# EAGLE design Shruti-Main-v03 (EAGLE 5.06)
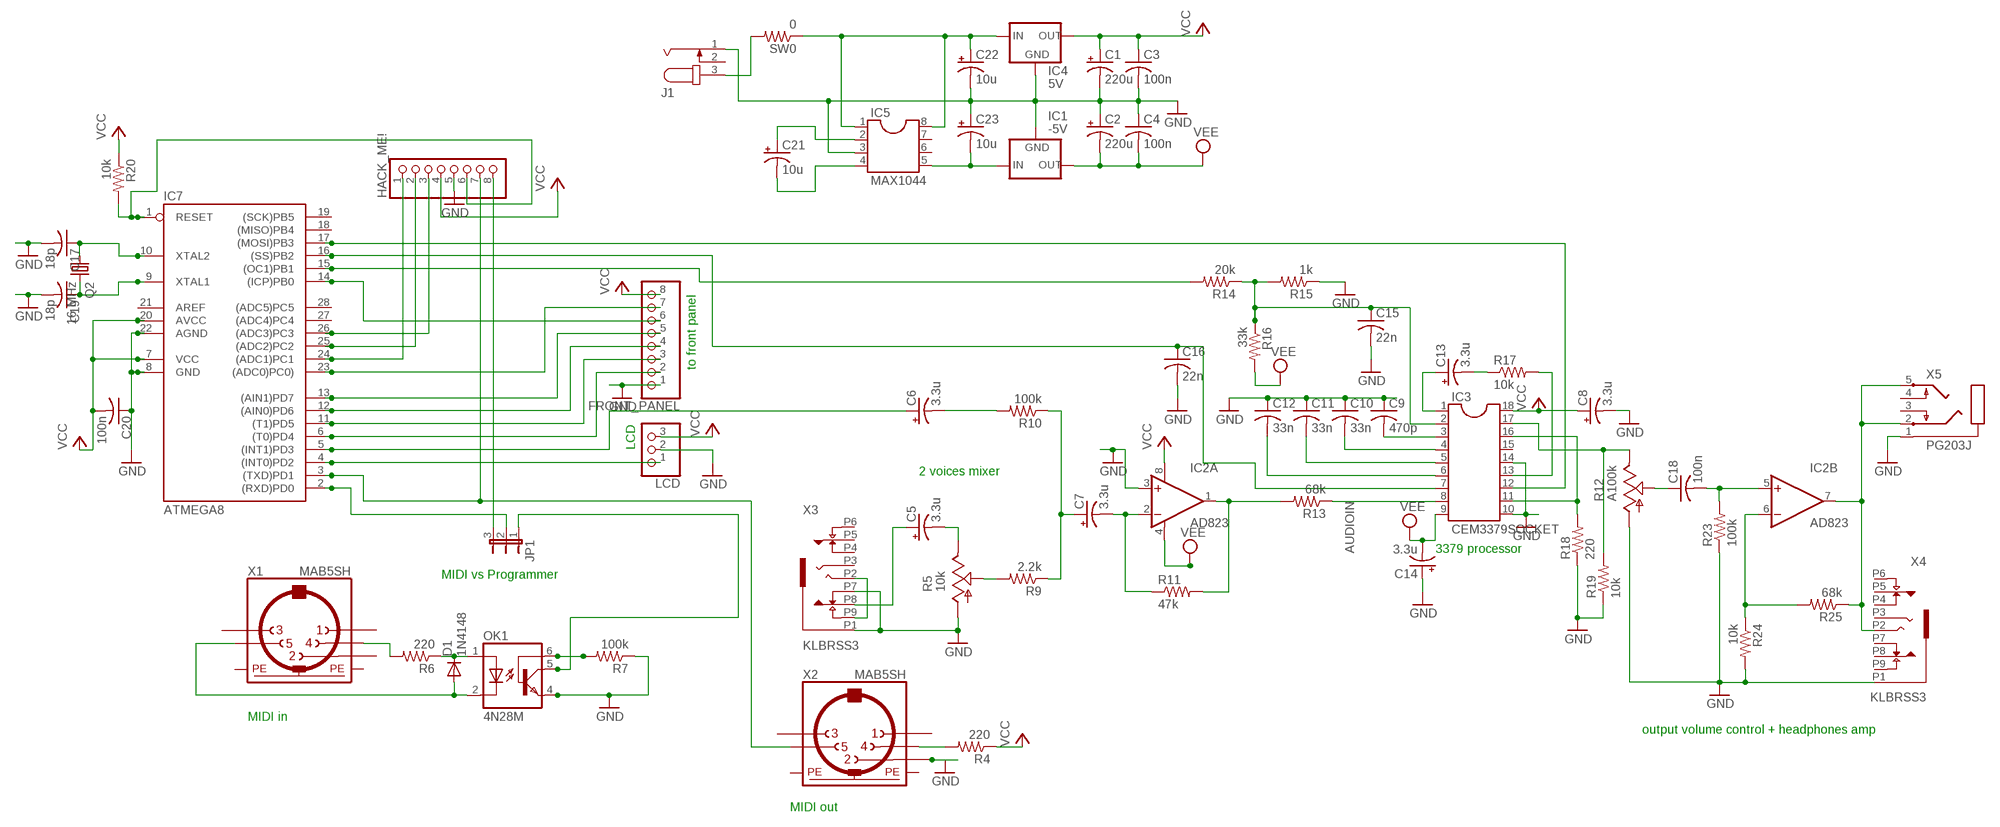
[diagram p0: schematic, sheet 1]

## Parts
C1  220u  CPOL-USE5-8.5  [E5-8,5]
C2  220u  CPOL-USE5-8.5  [E5-8,5]
C3  100n  C-US050-024X044  [C050-024X044]
C4  100n  C-US050-024X044  [C050-024X044]
C5  3.3u  CPOL-USE2.5-6  [E2,5-6]
C6  3.3u  CPOL-USE2.5-6  [E2,5-6]
C7  3.3u  CPOL-USE2.5-6  [E2,5-6]
C8  3.3u  CPOL-USE2.5-6  [E2,5-6]
C9  470p  C-US050-024X044  [C050-024X044]
C10  33n  C-US050-025X075  [C050-025X075]
C11  33n  C-US050-025X075  [C050-025X075]
C12  33n  C-US050-025X075  [C050-025X075]
C13  3.3u  CPOL-USE2.5-6  [E2,5-6]
C14  3.3u  CPOL-USE2.5-6  [E2,5-6]
C15  22n  C-US050-025X075  [C050-025X075]
C16  22n  C-US050-025X075  [C050-025X075]
C17  18p  C-US050-024X044  [C050-024X044]
C18  100n  C-US050-024X044  [C050-024X044]
C19  18p  C-US050-024X044  [C050-024X044]
C20  100n  C-US050-024X044  [C050-024X044]
C21  10u  CPOL-USE2.5-6  [E2,5-6]
C22  10u  CPOL-USE2.5-6  [E2,5-6]
C23  10u  CPOL-USE2.5-6  [E2,5-6]
D1  1N4148  1N4148DO35-7  [DO35-7]
FRONT_PANEL  PINHD-1X8  [1X08]
HACK_ME!  PINHD-1X8  [1X08]
IC1  -5V  79XXL  [79XXL]
IC2  AD823  OPA2132P  [DIL08]
IC3  CEM3379SOCKET  [SOCKET18]
IC4  5V  78XXL  [78XXL]
IC5  MAX1044  DIL8  [DIL08]
IC7  ATMEGA8  AT90S4433P  [DIL28-3]
J1  JACK-PLUG1  [SPC4078]
JP1  JP2E  [JP2]
LCD  PINHD-1X3  [1X03]
OK1  4N28M  [DIL06]
Q2  16 MHz  CRYSTALHC49U-V  [HC49U-V]
R4  220  R-US_0204/7  [0204/7]
R5  10k  POT_USCABLED  [CABLE_POT_6MM]
R6  220  R-US_0204/7  [0204/7]
R7  100k  R-US_0204/7  [0204/7]
R9  2.2k  R-US_0204/7  [0204/7]
R10  100k  R-US_0204/7  [0204/7]
R11  47k  R-US_0204/7  [0204/7]
R12  A100k  POT_USCABLED  [CABLE_POT_6MM]
R13  68k  R-US_0204/7  [0204/7]
R14  20k  R-US_0204/7  [0204/7]
R15  1k  R-US_0204/7  [0204/7]
R16  33k  R-US_0204/7  [0204/7]
R17  10k  R-US_0204/7  [0204/7]
R18  220  R-US_0204/7  [0204/7]
R19  10k  R-US_0204/7  [0204/7]
R20  10k  R-US_0204/7  [0204/7]
R23  100k  R-US_0204/7  [0204/7]
R24  10k  R-US_0204/7  [0204/7]
R25  68k  R-US_0204/7  [0204/7]
SW0  0  R-US_0204/2V  [0204V]
X1  MAB5SH  [MAB5SH]
X2  MAB5SH  [MAB5SH]
X3  KLBRSS3  [KLBRSS3]
X4  KLBRSS3  [KLBRSS3]
X5  PG203J  [PG203J]

## Nets
AUDIOIN: IC2.1(A:OUT) R11.2 R13.2
GND: C1.- C2.+ C3.2 C4.1 C8.- C9.1 C10.1 C11.1 C12.1 C14.+ C15.2 C16.2 C17.2 C19.2 C20.1 C22.- C23.+ FRONT_PANEL.1 HACK_ME!.5 IC1.GND IC2.3(A:+IN) IC3.10(GND) IC3.14(PANCV) IC4.GND IC5.3 IC7.8(GND) IC7.22(AGND) J1.1 LCD.2 OK1.4(EMI) R5.A R7.1 R12.A R15.1 R18.1 R19.1 R23.1 R24.2 X2.2 X3.P1 X3.P7 X4.P1 X5.1
N$1: HACK_ME!.8 JP1.3
N$2: C22.+ IC4.IN IC5.1 IC5.8 SW0.1
N$3: C21.+ IC5.2
N$4: FRONT_PANEL.2 IC7.6((T0)PD4)
N$5: IC3.8(VCFIN) R13.1
N$6: R4.2 X2.4
N$7: HACK_ME!.2 IC7.25((ADC2)PC2)
N$8: FRONT_PANEL.7 IC7.23((ADC0)PC0))
N$9: FRONT_PANEL.4 IC7.12((AIN0)PD6)
N$10: FRONT_PANEL.5 IC7.13((AIN1)PD7)
N$11: IC7.4((INT0)PD2) LCD.1
N$12: C6.- R10.2
N$13: HACK_ME!.7 IC7.3((TXD)PD1) X2.5
N$14: D1.C OK1.1(A) R6.1
N$15: C17.1 IC7.10(XTAL2) Q2.1
N$16: D1.A OK1.2(C) X1.5
N$17: R6.2 X1.4
N$18: JP1.1 OK1.5(COL)
N$19: R5.S R9.2
N$20: C6.+ IC7.5((INT1)PD3)
N$21: C7.- IC2.2(A:-IN) R11.1
N$22: FRONT_PANEL.3 IC7.11((T1)PD5)
N$23: C7.+ R9.1 R10.1
N$25: C18.2 IC2.5(B:+IN) R23.2
N$26: C9.2 IC3.3(CD)
N$27: C10.2 IC3.4(CC)
N$28: C5.- R5.E
N$29: C11.2 IC3.5(CB)
N$30: IC3.17(CHB) R12.E R19.2
N$31: C12.2 IC3.6(CA)
N$32: IC7.15((OC1)PB1) R14.2
N$33: C16.1 IC3.7(RESONANCECV) IC7.16((SS)PB2)
N$34: IC3.12(GAINCV) IC7.17((MOSI)PB3)
N$35: IC3.13(VCAIN) R17.2
N$36: C13.- R17.1
N$37: IC2.7(B:OUT) R25.1 X4.P2 X5.2 X5.5
N$38: IC3.11(VCAOUT) IC3.16(PANIN) R18.2
N$39: C13.+ IC3.1(VCFOUT)
N$41: C5.+ X3.P8
N$42: HACK_ME!.6 IC7.1(RESET) R20.2
N$43: C15.1 IC3.2(FREQUENCYCV) R14.1 R15.2 R16.1
N$44: C18.1 R12.S
N$45: IC2.6(B:-IN) R24.1 R25.2
N$47: J1.3 SW0.2
N$48: C19.1 IC7.9(XTAL1) Q2.2
N$49: HACK_ME!.3 IC7.26((ADC3)PC3)
N$50: FRONT_PANEL.6 IC7.14((ICP)PB0)
N$51: OK1.6(BAS) R7.2
N$52: HACK_ME!.1 IC7.24((ADC1)PC1)
N$53: IC7.2((RXD)PD0) JP1.2
N$55: C21.- IC5.4
N$56: C23.- IC1.IN IC5.5
N$57: X3.P2 X3.P9
VCC: C1.+ C3.1 C8.+ C20.2 FRONT_PANEL.8 HACK_ME!.4 IC2.8(A:V+) IC3.18(VCC) IC4.OUT IC7.7(VCC) IC7.20(AVCC) LCD.3 R4.1 R20.1
VEE: C2.- C4.2 C14.- IC1.OUT IC2.4(A:V-) IC3.9(VEE) R16.2
Unconnected: IC3.15(CHAOUT) IC5.6 IC5.7 IC7.18((MISO)PB4) IC7.19((SCK)PB5) IC7.21(AREF) IC7.27((ADC4)PC4) IC7.28((ADC5)PC5) J1.2 X1.1 X1.2 X1.3 X2.1 X2.3 X3.P3 X3.P4 X3.P5 X3.P6 X4.P3 X4.P4 X4.P5 X4.P6 X4.P7 X4.P8 X4.P9 X5.3 X5.4

## Notes on the sheet
- to front panel
- LCD
- 2 voices mixer
- 3379 processor
- MIDI vs Programmer
- MIDI in
- output volume control + headphones amp
- MIDI out

## Power pins joined to a net without a drawn wire
PE: X1.PE X1.PE@(PE) X2.PE X2.PE@(PE)

## Library data of the parts
C1 C2 C5-C8 C13 C14 C21-C23 = rcl:CPOL-US: POLARIZED CAPACITOR, American symbol
C3 C4 C9-C12 C15-C20 = rcl:C-US: CAPACITOR, American symbol
D1 = diode:1N4148: DIODE high speed (Philips)
FRONT_PANEL HACK_ME! = pinhead:PINHD-1X8: PIN HEADER
IC1 = v-reg:79XXL: VOLTAGE REGULATOR
IC2 = burr-brown:OPA2132: High Speed FET-Input Operational Amplifiers< Product Folder:OPA2132
IC3 = cem:CEM3379: Voltage Controlled Signal Processor VCF+VCA+panner
IC4 = v-reg:78XXL: VOLTAGE REGULATOR
IC5 = ic-package:DIL8: Dual In Line / Socket
IC7 = atmel:AT90S4433: MICROCONTROLLER 4 Kbytes FLASH 128 bytes SRAM 256 bytes EEPROM UART 6-channel 10 bit ADC
J1 = con-jack:JACK-PLUG: DC POWER JACK Power Jack, DC, Right Angle, Through Hole, Rated 5A at 16VDC, PC Terminals Distributor: Farnell (www.Farnell.de) Drawing: 84N1161.pdf / 84N1162.pdf Manufacturer: SPC Technology (www.spctechnology.com) Type: SPC4077 / SPC 4078
JP1 = jumper:JP2E: JUMPER
LCD = pinhead:PINHD-1X3: PIN HEADER
OK1 = optocoupler:4N*?M: General Purpose 6-Pin Phototransistor Optocouplers Source: http://www.fairchildsemi.com/ds/4N/4N35-M.pdf
Q2 = crystal:CRYSTAL: CRYSTAL
R4 R6 R7 R9-R11 R13-R20 R23-R25 SW0 = resistor:R-US_: RESISTOR, American symbol
R5 R12 = pot-cable:POT_US
X1 X2 = con-hirschmann:MAB5SH: Female CONNECTOR 5 pins 90 deg. with shield, horizontal (DIN 41524)
X3 X4 = klbrss3:KLBRSS3: 6.35" Jack connector
X5 = con-hirschmann:PG203J: MIC/HEADPHONE JACK KS-S stereo microphone/headphone jack PG203JN (Schukat)

## Board
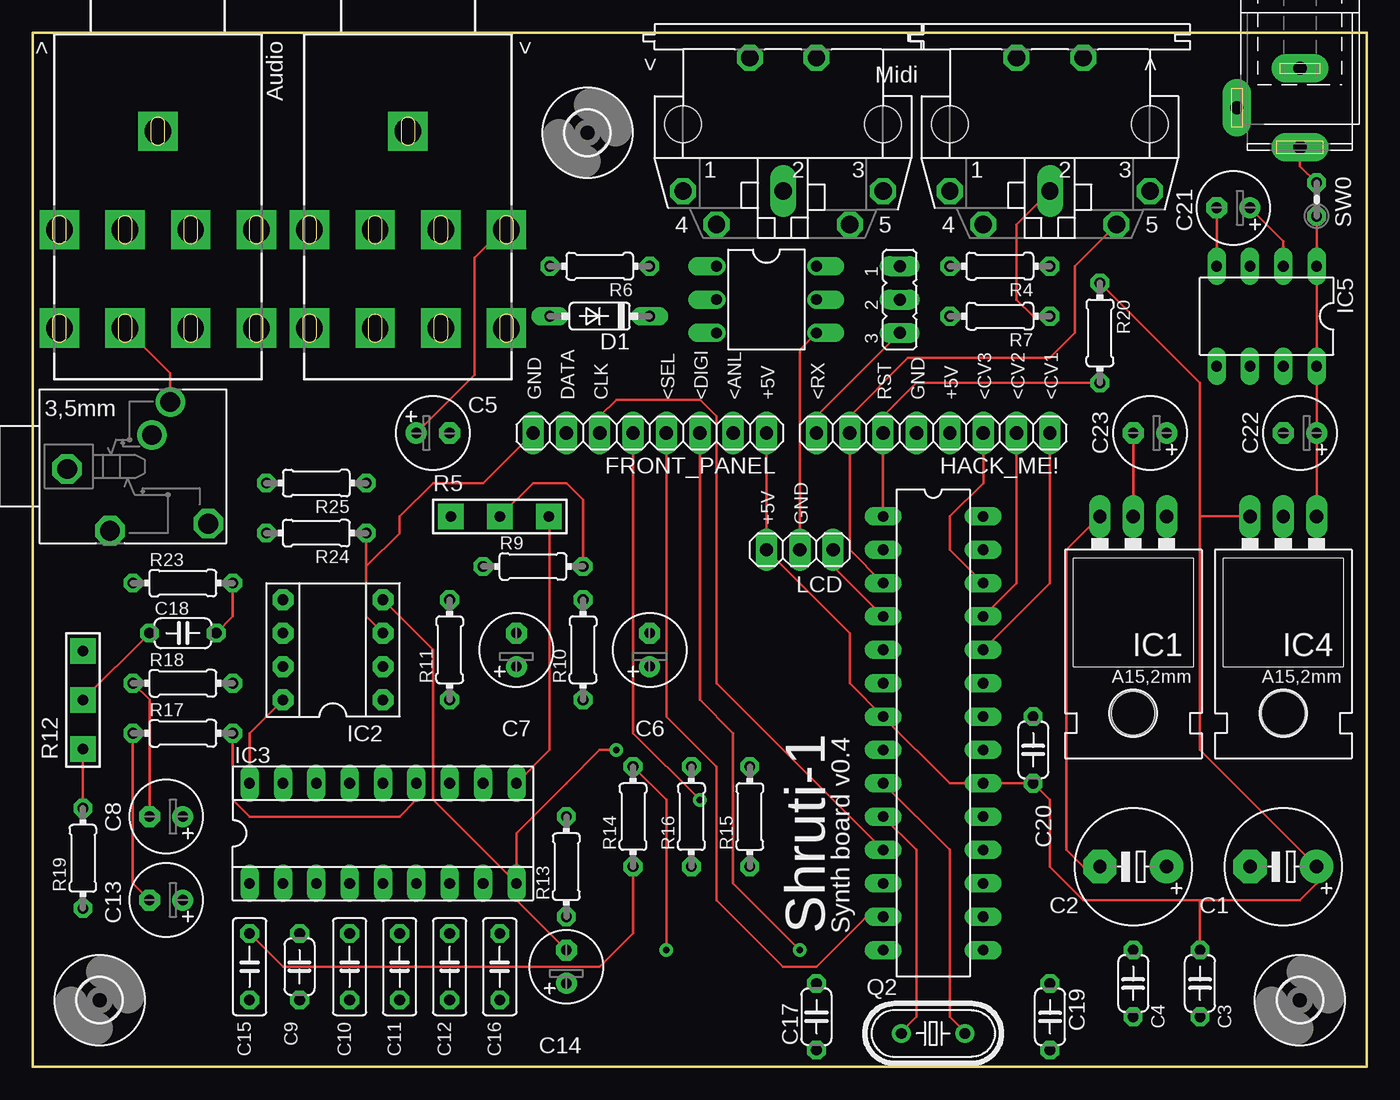
[diagram p1: board, top side]
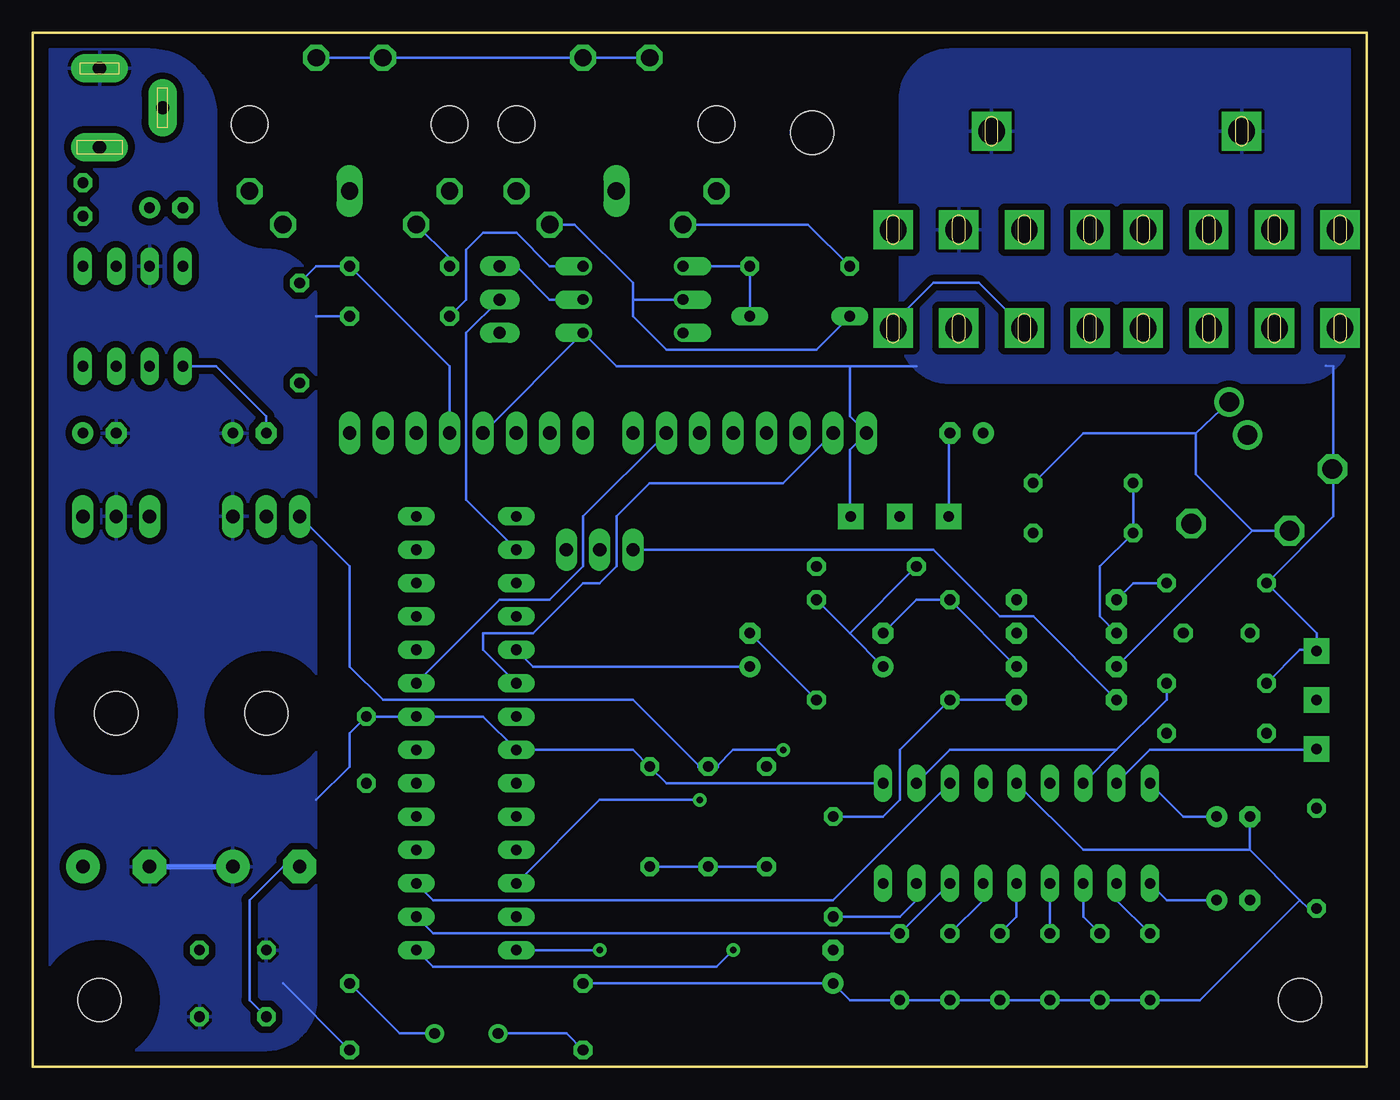
[diagram p2: board, bottom side, seen from below]

Size 101.6 x 78.73 mm. Coordinates in mm from the lower left corner, seen from the top.
Outline: 101.6,0 101.6,78.73 0,78.73 0,0 101.6,0
Copper layers (1*16): Top 0.035mm / dielectric 1.5mm / Bottom 0.035mm
Design rules "SparkFun": minimum track width 8mil, minimum drill 20mil, track to track 8mil, track to pad 8mil, pad to pad 8mil, via to via 8mil, smd to smd 8mil, copper to edge 10mil, drill to drill 8mil, minimum pad ring 12mil, minimum via ring 10mil, stop-mask expansion 4mil, vias tented up to drill 25mil, thermal gap 10mil

### Footprints (pad centres in the part's own frame; a part is rotated, then mirrored left to right if it is on the bottom)
E5-8,5 = drill 1.016 pad 2.54 round: + -2.54,0 | drill 1.016 pad 2.54 octagon: - 2.54,0
C050-024X044 = drill 0.813 octagon: 1 -2.54,0; 2 2.54,0
E2,5-6 = drill 0.813 pad 1.6 round: + -1.27,0 | drill 0.813 pad 1.6 octagon: - 1.27,0
C050-025X075 = drill 0.813 octagon: 1 -2.54,0; 2 2.54,0
DO35-7 = drill 0.813 long: A 3.81,0; C -3.81,0
1X08 = drill 1.016 long: 1 -8.89,0; 2 -6.35,0; 3 -3.81,0; 4 -1.27,0; 5 1.27,0; 6 3.81,0; 7 6.35,0; 8 8.89,0
79XXL = drill 1.016 long: GND -2.54,-3.81; IN 0,-3.81; OUT 2.54,-3.81 | hole 3.302: 0,11.176
DIL08 = drill 0.813 pad 1.6 octagon: 1 -3.81,-3.81; 2 -1.27,-3.81; 3 1.27,-3.81; 4 3.81,-3.81; 5 3.81,3.81; 6 1.27,3.81; 7 -1.27,3.81; 8 -3.81,3.81
SOCKET18 = drill 0.813 long: 1 -10.16,-3.81; 2 -7.62,-3.81; 3 -5.08,-3.81; 4 -2.54,-3.81; 5 0,-3.81; 6 2.54,-3.81; 7 5.08,-3.81; 8 7.62,-3.81; 9 10.16,-3.81; 10 10.16,3.81; 11 7.62,3.81; 12 5.08,3.81; 13 2.54,3.81; 14 0,3.81; 15 -2.54,3.81; 16 -5.08,3.81; 17 -7.62,3.81; 18 -10.16,3.81
78XXL = drill 1.016 long: GND 0,-3.81; IN -2.54,-3.81; OUT 2.54,-3.81 | hole 3.302: 0,11.176
DIL08' = drill 0.813 long: 1 -3.81,-3.81; 2 -1.27,-3.81; 3 1.27,-3.81; 4 3.81,-3.81; 5 3.81,3.81; 6 1.27,3.81; 7 -1.27,3.81; 8 -3.81,3.81
DIL28-3 = drill 0.813 long: 1 -16.51,-3.81; 2 -13.97,-3.81; 3 -11.43,-3.81; 4 -8.89,-3.81; 5 -6.35,-3.81; 6 -3.81,-3.81; 7 -1.27,-3.81; 8 1.27,-3.81; 9 3.81,-3.81; 10 6.35,-3.81; 11 8.89,-3.81; 12 11.43,-3.81; 13 13.97,-3.81; 14 16.51,-3.81; 15 16.51,3.81; 16 13.97,3.81; 17 11.43,3.81; 18 8.89,3.81; 19 6.35,3.81; 20 3.81,3.81; 21 1.27,3.81; 22 -1.27,3.81; 23 -3.81,3.81; 24 -6.35,3.81; 25 -8.89,3.81; 26 -11.43,3.81; 27 -13.97,3.81; 28 -16.51,3.81
SPC4078 = drill 1 pad 2.184 long: 1 -3,0; 2 0,-4.8; 3 3,0
JP2 = drill 0.914 long: 1 -2.54,0; 2 0,0; 3 2.54,0
1X03 = drill 1.016 long: 1 -2.54,0; 2 0,0; 3 2.54,0
DIL06 = drill 0.813 offset: 1 -2.54,-3.81; 2 0,-3.81; 3 2.54,-3.81; 4 2.54,3.81; 5 0,3.81; 6 -2.54,3.81
HC49U-V = drill 0.813 round: 1 -2.413,0; 2 2.413,0
0204/7 = drill 0.813 octagon: 1 -3.81,0; 2 3.81,0
CABLE_POT_6MM = drill 0.8 pad 1.93 square: A -3.73,0; E 3.73,0; S 0,0
0204V = drill 0.813 octagon: 1 -1.27,0; 2 1.27,0
3,3 = hole 3.3: 0,0
MAB5SH = drill 1.321 octagon: 1 7.62,5.08; 3 -7.62,5.08; 4 5.08,7.62; 5 -5.08,7.62; PE -2.54,-5.08; PE@ 2.54,-5.08 | drill 1.321 long: 2 0,5.08 | hole 2.794: 7.62,0; -7.62,0
KLBRSS3 = drill 2 pad 2.54 square: P1 0,-7.5; P2 -2.5,-22.5; P3 2.5,-22.5; P4 -2.5,-15; P5 -7.5,-15; P6 -7.5,-22.5; P7 2.5,-15; P8 7.5,-15; P9 7.5,-22.5
PG203J = drill 1.499 octagon: 1 -5.004,-0.203; 4 5.74,-4.369; 5 -1.753,-4.902 | drill 1.499 round: 2 2.845,4.902; 3 1.448,2.388

### Placement (x,y rotation side)
C1  95.25,15.24 180 top
C2  83.82,15.24 180 top
C3  88.9,6.35 270 top
C4  83.82,6.35 270 top
C5  30.48,48.26 0 top
C6  46.99,31.75 90 top
C7  36.83,31.75 90 top
C8  10.16,19.05 180 top
C9  20.32,7.62 90 top
C10  24.13,7.62 90 top
C11  27.94,7.62 90 top
C12  31.75,7.62 90 top
C13  10.16,12.7 180 top
C14  40.64,7.62 90 top
C15  16.51,7.62 270 top
C16  35.56,7.62 270 top
C17  59.69,3.81 90 top
C18  11.43,33.02 0 top
C19  77.47,3.81 270 top
C20  76.2,24.13 270 top
C21  91.44,65.41 180 top
C22  96.52,48.26 180 top
C23  85.09,48.26 180 top
D1  43.18,57.15 180 top
FRONT_PANEL  46.99,48.26 0 top
HACK_ME!  68.58,48.26 180 top
IC1  83.82,38.1 180 top
IC2  22.86,31.75 90 top
IC3  26.67,17.78 0 top
IC4  95.25,38.1 180 top
IC5  MAX1044  [DIL08']  93.98,57.15 180 top
IC7  68.58,25.4 270 top
J1  96.52,73.03 270 top
JP1  66.04,58.42 270 top
LCD  58.42,39.37 180 top
OK1  55.88,58.42 270 top
Q2  68.58,2.54 0 top
R4  73.66,60.96 180 top
R5  35.56,41.91 180 top
R6  43.18,60.96 180 top
R7  73.66,57.15 180 top
R9  38.1,38.1 0 top
R10  41.91,31.75 270 top
R11  31.75,31.75 270 top
R12  3.81,27.94 270 top
R13  40.64,15.24 90 top
R14  45.72,19.05 90 top
R15  54.61,19.05 270 top
R16  50.16,19.05 90 top
R17  11.43,25.4 0 top
R18  11.43,29.21 0 top
R19  3.81,15.88 90 top
R20  81.28,55.88 270 top
R23  11.43,36.83 0 top
R24  21.59,40.64 0 top
R25  21.59,44.45 180 top
SW0  97.79,66.04 90 top
U$2  [3,3]  96.52,5.08 0 top
U$3  [3,3]  5.08,5.08 0 top
U$4  [3,3]  42.24,71.12 0 top
X1  57.15,71.75 180 top
X2  77.47,71.75 180 top
X3  28.57,78.74 0 top
X4  9.53,78.74 0 top
X5  7.62,45.72 0 top

### Tracks (layer width: path | path; a pad name or v marks a point on that pad's centre or on a via)
AUDIOIN
  Bottom 0.203: IC2.1 R11.2 35.56,24.13 35.56,20.32 36.83,19.05 R13.2
GND
  Top 0.203: X2.2 74.93,64.14 74.93,58.42 76.2,57.15 R7.1 | IC2.3 25.4,34.29 25.4,38.1 | 25.4,38.1 R24.2 | R18.1 8.89,27.94 C8.- | IC3.10 39.37,24.13 39.37,41.91 R5.A | LCD.2 58.42,54.61 OK1.4 | FRONT_PANEL.1 34.29,44.45 30.48,44.45 27.94,41.91 27.94,40.64 25.4,38.1
  Bottom 0.203: 80.01,20.32 77.47,22.86 77.47,25.4 C20.1 IC7.22 67.31,26.67 IC7.8 55.88,24.13 R15.1 53.34,21.59 IC3.10 | R7.1 80.01,57.15 | R18.1 5.08,31.75 3.81,31.75 R12.A 3.81,33.02 R23.1 2.54,41.91 2.54,44.45 X5.1 2.54,45.72 2.54,53.34 3.13,53.36 | 5.08,12.7 8.89,16.51 | 5.08,12.7 4.45,12.06 R19.1 | 8.89,16.51 C8.- | IC3.14 21.59,16.51 8.89,16.51 | 5.08,12.7 12.7,5.08 C15.2 C9.1 C10.1 C11.1 C12.1 C16.2 39.37,5.08 C14.+ C17.2 | HACK_ME!.5 OK1.4 57.15,53.34 39.37,53.34 | 39.37,53.34 34.29,53.34 | R5.A 39.37,41.91 39.37,46.99 FRONT_PANEL.1 39.37,49.53 39.37,53.34 | C19.2 82.55,6.35 | X3.P7 30.48,63.7
  Bottom 0.406: C2.+ C1.-
  pour Bottom (isolate 0.508): 1.27,77.47 1.27,55.88 arc90 5.08,52.07 31.75,52.07 arc90 35.56,55.88 35.56,73.66 arc90 31.75,77.47
  pour Bottom (isolate 0.508): 100.33,1.27 83.82,1.27 arc-90 80.01,5.08 80.01,58.42 arc-90 83.82,62.23 arc90 87.63,66.04 87.63,72.39 arc-90 92.71,77.47 100.33,77.47
N$1
  Top 0.203: HACK_ME!.8 59.69,49.53 JP1.3
N$2
  Top 0.203: SW0.1 IC5.1 IC5.8 C22.+ IC4.IN
N$3
  Top 0.203: C21.+ 95.25,62.87 IC5.2
N$4
  Bottom 0.203: IC7.6 67.31,31.75 67.31,33.02 63.5,33.02 59.69,36.83 58.42,36.83 57.15,38.1 57.15,41.91 54.61,44.45 44.45,44.45 FRONT_PANEL.2
N$5
  Bottom 0.203: IC3.8 34.29,12.7 35.56,11.43 R13.1
N$6
  Bottom 0.203: R4.2 69.85,61.59 X2.4
N$7
  Top 0.203: IC7.25 74.93,36.83 HACK_ME!.2
N$8
  Bottom 0.203: IC7.23 66.04,35.56 62.23,35.56 59.69,38.1 59.69,41.91 FRONT_PANEL.7
N$9  (via drill 0.51)
  Top 0.203: v50.8,20.32 45.72,25.4 FRONT_PANEL.4
  Bottom 0.203: IC7.12 58.42,20.32 v50.8,20.32
N$10
  Top 0.203: IC7.13 63.5,11.43 59.69,7.62 57.15,7.62 52.07,12.7 52.07,22.86 48.26,26.67 FRONT_PANEL.5
N$11
  Top 0.203: IC7.4 60.96,38.1 LCD.1
N$12
  Bottom 0.203: R10.2 C6.-
N$13
  Top 0.203: X2.5 79.38,60.96 79.38,55.88 77.47,53.98 66.67,53.98 62.23,49.53 HACK_ME!.7 62.23,39.37 IC7.3
N$14
  Bottom 0.203: OK1.1 R6.1 D1.C
N$15
  Top 0.203: IC7.10 67.31,16.51 67.31,3.81 66.17,2.67 Q2.1
  Bottom 0.203: C17.1 60.96,2.54 Q2.1
N$16
  Bottom 0.203: D1.A 41.91,54.61 53.34,54.61 55.88,57.15 55.88,58.42 | 55.88,58.42 55.88,59.69 60.33,64.14 X1.5 | 55.88,58.42 OK1.2
N$17
  Bottom 0.203: R6.2 42.55,64.14 X1.4
N$18
  Bottom 0.203: OK1.5 62.23,58.42 64.77,60.96 JP1.1
N$19
  Top 0.203: R5.S 38.1,44.45 40.64,44.45 41.91,43.18 R9.2
N$20
  Bottom 0.203: IC7.5 63.5,30.48 C6.+
N$21
  Bottom 0.203: IC2.2 R11.1 34.29,35.56 C7.-
N$22
  Top 0.203: IC7.11 52.07,29.21 52.07,49.53 50.8,50.8 44.45,50.8 43.18,49.53 FRONT_PANEL.3
N$23
  Bottom 0.203: C7.+ 39.37,33.02 | 39.37,33.02 R10.1 | 39.37,33.02 R9.1
N$25
  Top 0.203: C18.2 15.24,34.29 R23.2
  Bottom 0.203: IC2.5 17.78,36.83 R23.2
N$26
  Bottom 0.203: C9.2 21.59,11.43 IC3.3
N$27
  Bottom 0.203: C10.2 IC3.4
N$28
  Bottom 0.203: C5.- 31.83,48.18 R5.E
N$29
  Bottom 0.203: C11.2 26.67,11.43 IC3.5
N$30
  Top 0.203: R19.2 R12.E
  Bottom 0.203: IC3.17 16.51,24.13 3.81,24.13 R12.E
N$31
  Bottom 0.203: C12.2 29.21,12.7 IC3.6
N$32  (via drill 0.51)
  Top 0.203: R14.2 48.26,20.32 v48.26,8.89
  Bottom 0.203: v48.26,8.89 49.53,7.62 71.12,7.62 IC7.15
N$33
  Bottom 0.203: IC3.7 C16.1 71.12,10.16 IC7.16
N$34
  Bottom 0.203: IC3.12 40.64,12.7 71.12,12.7 IC7.17
N$35
  Top 0.203: R17.2 15.24,20.32 16.51,19.05 27.94,19.05 29.21,20.32 IC3.13
N$36
  Top 0.203: R17.1 7.62,13.97 C13.-
N$37
  Top 0.203: X5.2 10.46,52.8 X4.P2
  Bottom 0.203: 8.71,40.82 IC2.7 | X5.5 8.71,40.82 | 8.71,40.82 13.01,45.11 13.01,48.26 | 13.01,48.26 X5.2 | R25.1 21.59,48.26 13.01,48.26
N$38
  Bottom 0.203: 19.05,24.13 15.24,27.94 R18.2 | IC3.16 19.05,24.13 | IC3.11 31.75,24.13 19.05,24.13
N$39
  Bottom 0.203: IC3.1 15.24,12.7 C13.+
N$41
  Top 0.203: C5.+ 33.66,52.7 33.66,61.59 35.44,63.38 X3.P8
N$42
  Top 0.203: IC7.1 HACK_ME!.6 64.77,49.53 67.31,52.07 R20.2
N$43
  Top 0.203: C15.1 19.05,7.62 43.18,7.62 45.72,10.16 R14.1
  Bottom 0.203: C15.1 19.05,12.7 IC3.2 | R14.1 R16.1 R15.2
N$44
  Top 0.203: R12.S C18.1
N$45
  Bottom 0.203: IC2.6 20.32,34.29 20.32,38.1 R24.1 R25.2
N$47
  Top 0.203: J1.3 96.52,68.58 SW0.2
N$48
  Top 0.203: IC7.9 69.85,16.51 69.85,3.81 71.12,2.54 Q2.2
  Bottom 0.203: C19.1 73.66,2.54 Q2.2
N$49
  Top 0.203: IC7.26 69.85,39.37 69.85,41.91 72.39,44.45 HACK_ME!.3
N$50  (via drill 0.51)
  Top 0.203: v58.42,8.89 53.34,13.97 53.34,25.4 50.8,27.94 FRONT_PANEL.6
  Bottom 0.203: v58.42,8.89 IC7.14
N$51
  Bottom 0.203: OK1.6 62.23,60.96 64.77,63.5 67.31,63.5 68.58,62.23 68.58,58.42 R7.2
N$52
  Top 0.203: HACK_ME!.1 77.47,36.83 IC7.24
N$53
  Bottom 0.203: JP1.2 68.58,55.88 68.58,43.18 IC7.2
N$55
  Top 0.203: IC5.4 C21.-
N$56
  Top 0.203: IC1.IN C23.-
  Bottom 0.203: IC5.5 87.63,53.34 83.82,49.53 C23.-
N$57
  Bottom 0.203: X3.P2 29.52,59.69 33.02,59.69 36.08,56.63 X3.P9
PE
  Bottom 0.203: X1.PE@ X1.PE X2.PE@ X2.PE
VCC
  Top 0.203: R20.1 88.9,52.07 88.9,41.91 | 88.9,41.91 88.9,24.13 C1.+ 97.79,13.97 96.52,12.7 88.9,12.7 | 88.9,41.91 IC4.OUT | 88.9,12.7 80.01,12.7 77.47,15.24 77.47,20.32 C20.2 IC7.20 69.85,21.59 IC7.7 62.23,29.21 62.23,33.02 LCD.3 FRONT_PANEL.8 | 88.9,12.7 C3.1 | IC2.8 16.51,25.4 IC3.18
  Bottom 0.203: R20.1 80.01,60.96 R4.1 69.85,53.34 HACK_ME!.4 | IC3.18 13.97,19.05 C8.+ | IC2.8 25.4,34.29 27.94,34.29 33.02,39.37 LCD.3
VEE  (via drill 0.51)
  Top 0.203: IC1.OUT 78.74,39.37 78.74,16.51 80.01,15.24 C2.- | IC2.4 30.48,31.75 30.48,20.32 IC3.9 | C14.- 36.83,12.7 IC3.9 | IC3.9 36.83,17.78 40.64,21.59 43.18,24.13 v44.45,24.13
  Bottom 0.203: IC1.OUT 77.47,38.1 77.47,30.48 74.93,27.94 55.88,27.94 50.8,22.86 | C2.- 82.55,15.24 85.09,12.7 85.09,5.08 C4.2 | 49.53,22.86 48.26,24.13 v44.45,24.13
  Bottom 0.406: 49.53,22.86 R16.2 50.8,22.86

### Text on the board
tPlace: > | Audio | < | < | > | Midi | GND | DATA | CLK | <SEL | <DIGI | <ANL | +5V | <RX | RST | GND | +5V | <CV3 | <CV2 | <CV1 | +5V | GND | Shruti-1
tNames: Synth board v0.4
license: ol.gillet@gmail.com | cc-by-nc-sa 3.0